# Altium schematic sheet Power_Distribution_2021_9V.SchDoc
size A; SheetNumber: 3; SheetTotal: 3
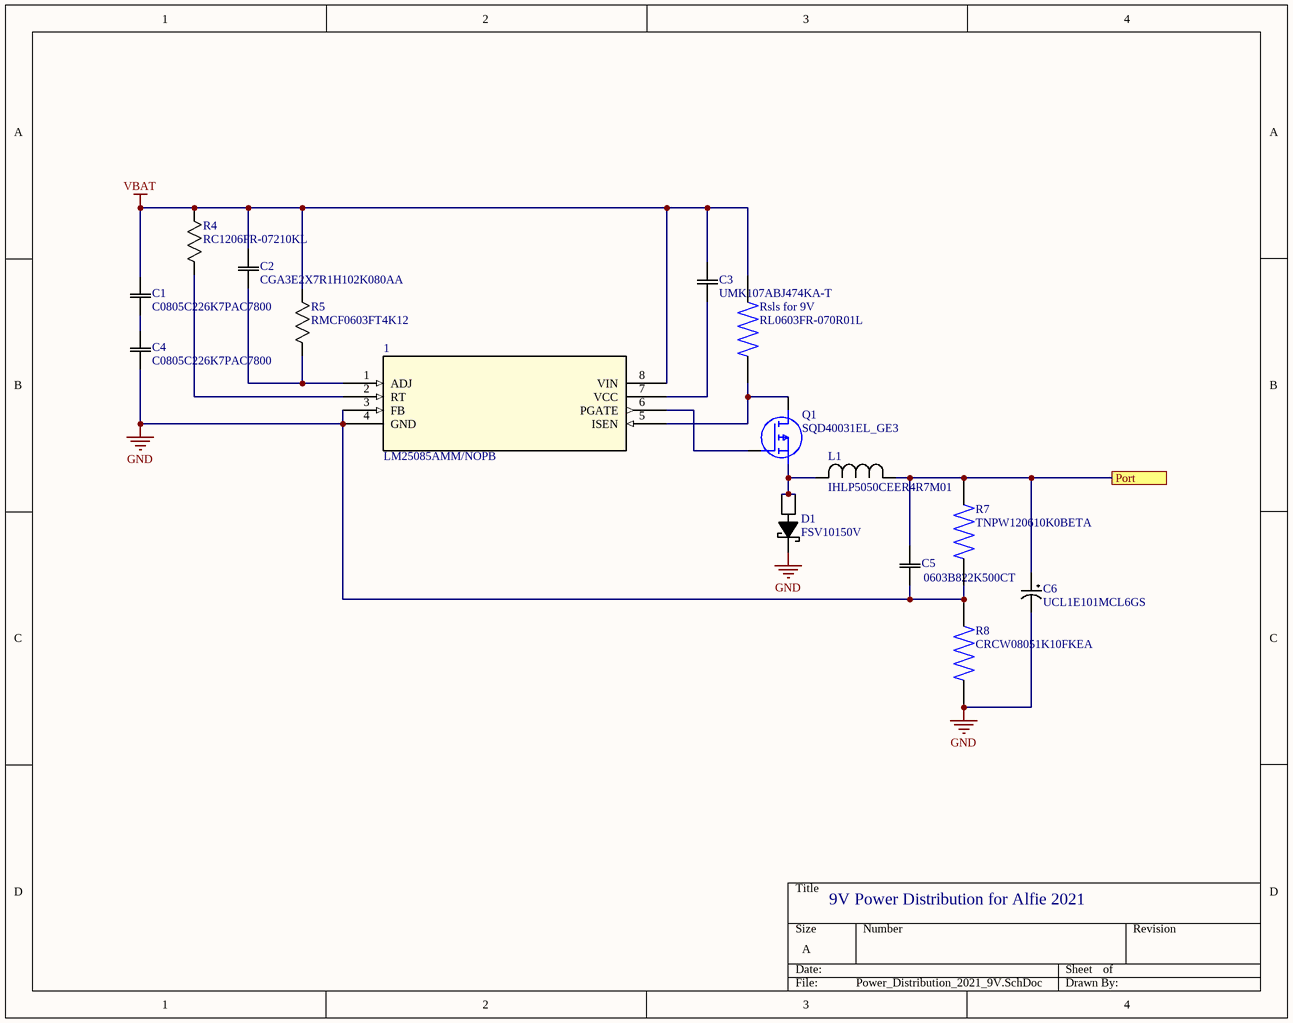
[diagram p0: Power_Distribution_2021_9V.SchDoc]

## Parts
1  LM25085AMM/NOPB  [MUA08A]
C1  C0805C226K7PAC7800  [CAPC2012X140N]
C2  CGA3E2X7R1H102K080AA  [CAP_1608_TDK]
C3  UMK107ABJ474KA-T  [cap_UMK107ABJ474KA-T_TAY]
C4  C0805C226K7PAC7800  [CAPC2012X140N]
C5  0603B822K500CT  [CAP_0603_S_WAL]
C6  UCL1E101MCL6GS  [U2-O_NCH]
D1  FSV10150V  [TO-277_3L]
L1  IHLP5050CEER4R7M01  [IND_IHLP-5050CE_VIS]
Q1  SQD40031EL_GE3  [SQD40031EL_GE3]
R4  RC1206FR-07210KL  [RC1206N_YAG]
R5  RMCF0603FT4K12  [STA_RMCF0603_STP]
R7  TNPW120610K0BETA  [RESC3216X65N]
R8  CRCW08051K10FKEA  [RESC2012X50N]
Rsls_for_9V  RL0603FR-070R01L  [RESC1608X55N]

## Ports
Port

## Nets
GND: 1.3(FB) 1.4(GND) C4.1 C5.1 C6.2 D1.2 R7.1 R8.1 R8.2
VBAT: 1.8(VIN) C1.2 C2.2 C3.1 R4.1 R5.2 Rsls_for_9V.2
Port: C5.2 C6.1 L1.1 R7.2 ; port Port
Net1_1: 1.1(ADJ) C2.1 R5.1
Net1_2: 1.2(RT) R4.2
Net1_5: 1.5(ISEN) Q1.3(D) Rsls_for_9V.1
Net1_6: 1.6(PGATE) Q1.1(G)
Net1_7: 1.7(VCC) C3.2
NetC1_1: C1.1 C4.2
NetD1_0: D1.0 D1.1 L1.2 Q1.2(S)

## Notes on the sheet
- 9V Power Distribution for Alfie 2021

## Library data of the parts
1 = LM25085AMM/NOPB: IC REG CTRLR BUCK 8VSSOP; Vendor: National; Manufacturer_Part_Number: LM25085AMM/NOPB; Copyright: Copyright (C) 2021 Accelerated Designs. All rights reserved; RefDes: RefDes; Type: DEV
C1 C4 = C0805C226K7PAC7800: 22µF ±10% 4V Ceramic Capacitor X5R 0805 _2012 Metric; MF: KEMET; SnapEDA_Link: https://www.snapeda.com/parts/C0805C226K7PAC7800/KEMET/view-part/3927428/?ref=snap; Price: None; Availability: Unavailable; Value: *; MP: C0805C226K7PAC7800; Package: 2012 KEMET
C2 = CGA3E2X7R1H102K080AA: CAP CER 1000PF 50V X7R 0603; Vendor: TDK; Built_By: EMA_UL_Team; SourceLibrary: TDK_2015_05_22; Type: DEV; Manufacturer_Part_Number: CGA3E2X7R1H102K080AA; Copyright: Copyright (C) 2021 Accelerated Designs. All rights reserved; RefDes: RefDes
C3 = UMK107ABJ474KA-T: CAP CER 0.47UF 50V X5R 0603; Vendor: Taiyo Yuden; Built_By: EMA_UL_Team; SourceLibrary: Taiyo_Yuden_2018-10-17; Type: DEV; Manufacturer_Part_Number: UMK107ABJ474KA-T; Copyright: Copyright (C) 2018 Accelerated Designs. All rights reserved; RefDes: RefDes
C5 = 0603B822K500CT: CAP CER 8200PF 50V X7R 0603; Vendor: Walsin; Built_By: EMA_UL_Team; SourceLibrary: Walsin_2016-07-18_2; Type: DEV; Manufacturer_Part_Number: 0603B822K500CT; Copyright: Copyright (C) 2021 Accelerated Designs. All rights reserved; RefDes: RefDes
C6 = UCL1E101MCL6GS: CAP ALUM 100UF 20% 25V SMD; Vendor: Nichicon; Built_By: EMA_UL_Team; SourceLibrary: Nichicon_2014-12-31; Type: DEV; Manufacturer_Part_Number: UCL1E101MCL6GS; Copyright: Copyright (C) 2021 Accelerated Designs. All rights reserved; RefDes: RefDes
D1 = FSV10150V: DIODE SCHOTTKY 150V 10A TO277-3
L1 = IHLP5050CEER4R7M01: FIXED IND 4.7UH 10A 15 MOHM SMD; Vendor: VISHAY; Built_By: EMA_UL_Team; SourceLibrary: Vishay_2010-01-01_IND_IHLP; Type: DEV; Manufacturer_Part_Number: IHLP5050CEER4R7M01; Copyright: Copyright (C) 2021 Accelerated Designs. All rights reserved; RefDes: RefDes
Q1 = SQD40031EL_GE3: MOSFET (P-Channel); Manufacturer_Name: Vishay; Datasheet Link: https://www.vishay.com/docs/76011/sqd40031el.pdf; Height: 2.38mm; Manufacturer_Part_Number: SQD40031EL_GE3
R4 = RC1206FR-07210KL: RES SMD 210K OHM 1% 1/4W 1206; Vendor: Yageo; Built_By: EMA_UL_Team; SourceLibrary: Yageo_2008-01-01_ChipRes2a; Manufacturer_Part_Number: RC1206FR-07210KL; Copyright: Copyright (C) 2021 Accelerated Designs. All rights reserved; RefDes: RefDes; Type: DEV
R5 = RMCF0603FT4K12: RES 4.12K OHM 1% 1/10W 0603; Vendor: Stackpole International; Built_By: EMA_UL_Team; SourceLibrary: Stackpole_2014-12-31; Manufacturer_Part_Number: RMCF0603FT4K12; Copyright: Copyright (C) 2021 Accelerated Designs. All rights reserved; RefDes: RefDes; Type: DEV
R7 = TNPW120610K0BETA: Res Thin Film 1206 10K Ohm 0.1% 0.25W(1/4W) ?25ppm/C Molded SMD T/R; Package: None; Price: None; Value: *; MP: TNPW120610K0BETA; Availability: Unavailable
R8 = CRCW08051K10FKEA: D12/Crcw0805 100 1K1 1% Et1 E3; Package: None; Price: None; Value: *; MP: CRCW08051K10FKEA; Availability: Unavailable
Rsls_for_9V = RL0603FR-070R01L: .01 OHM 1% 1/10W; Package: None; Price: None; Value: *; MP: RL0603FR-070R01L; Availability: Unavailable